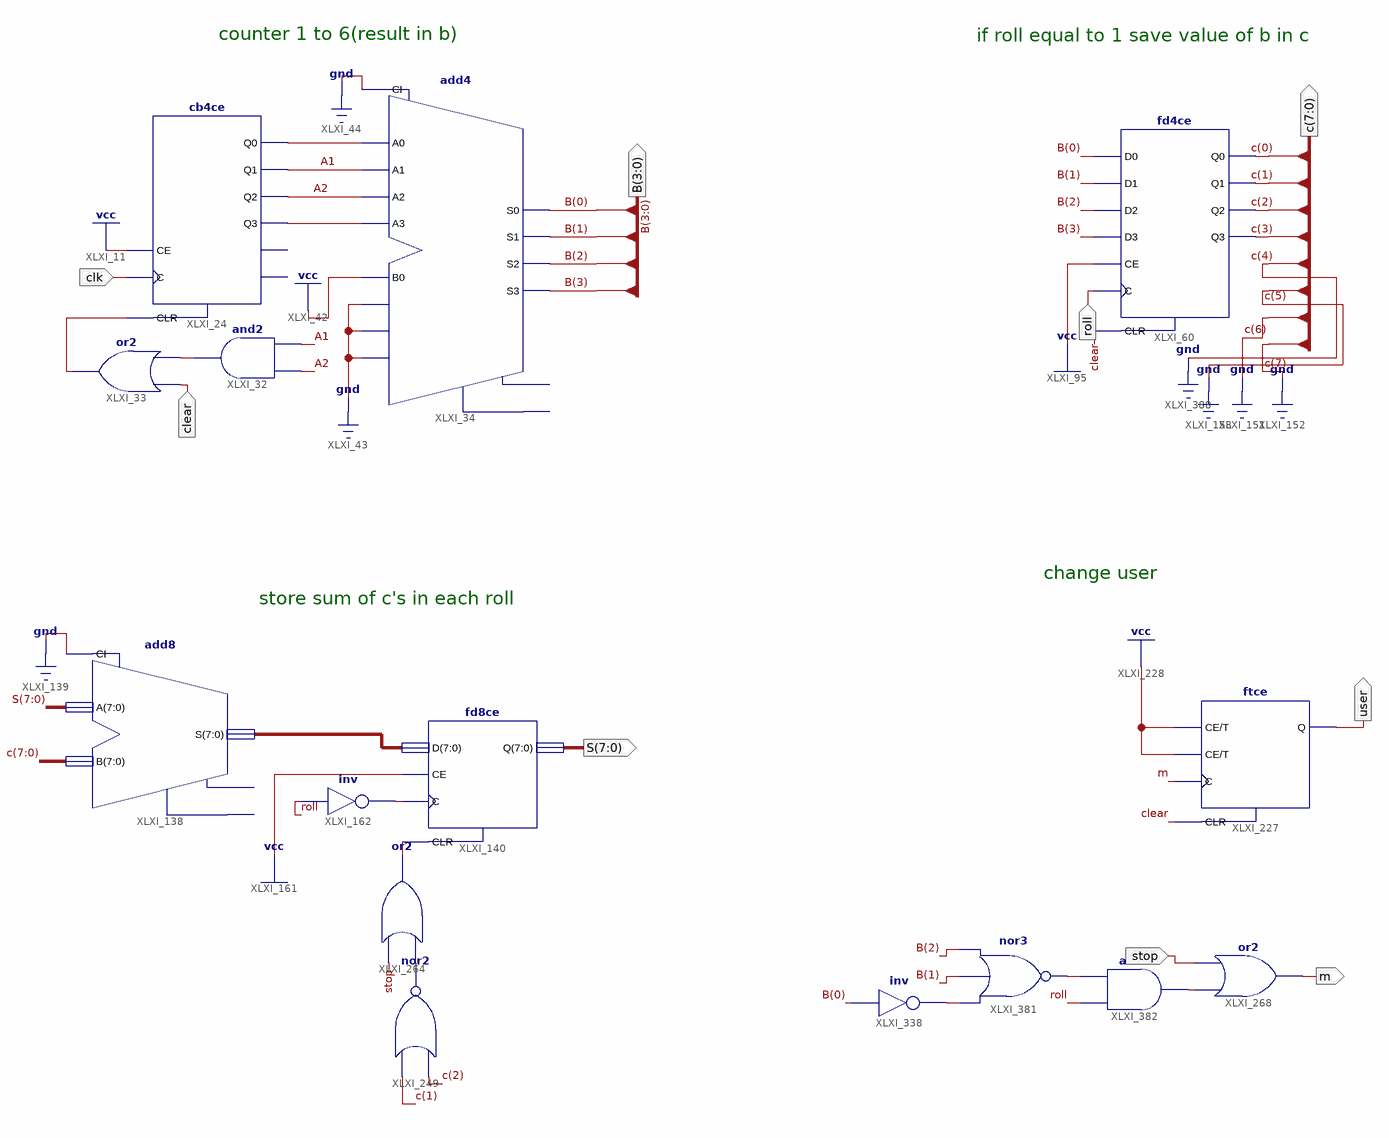
[diagram p0: schematic sheet 1]
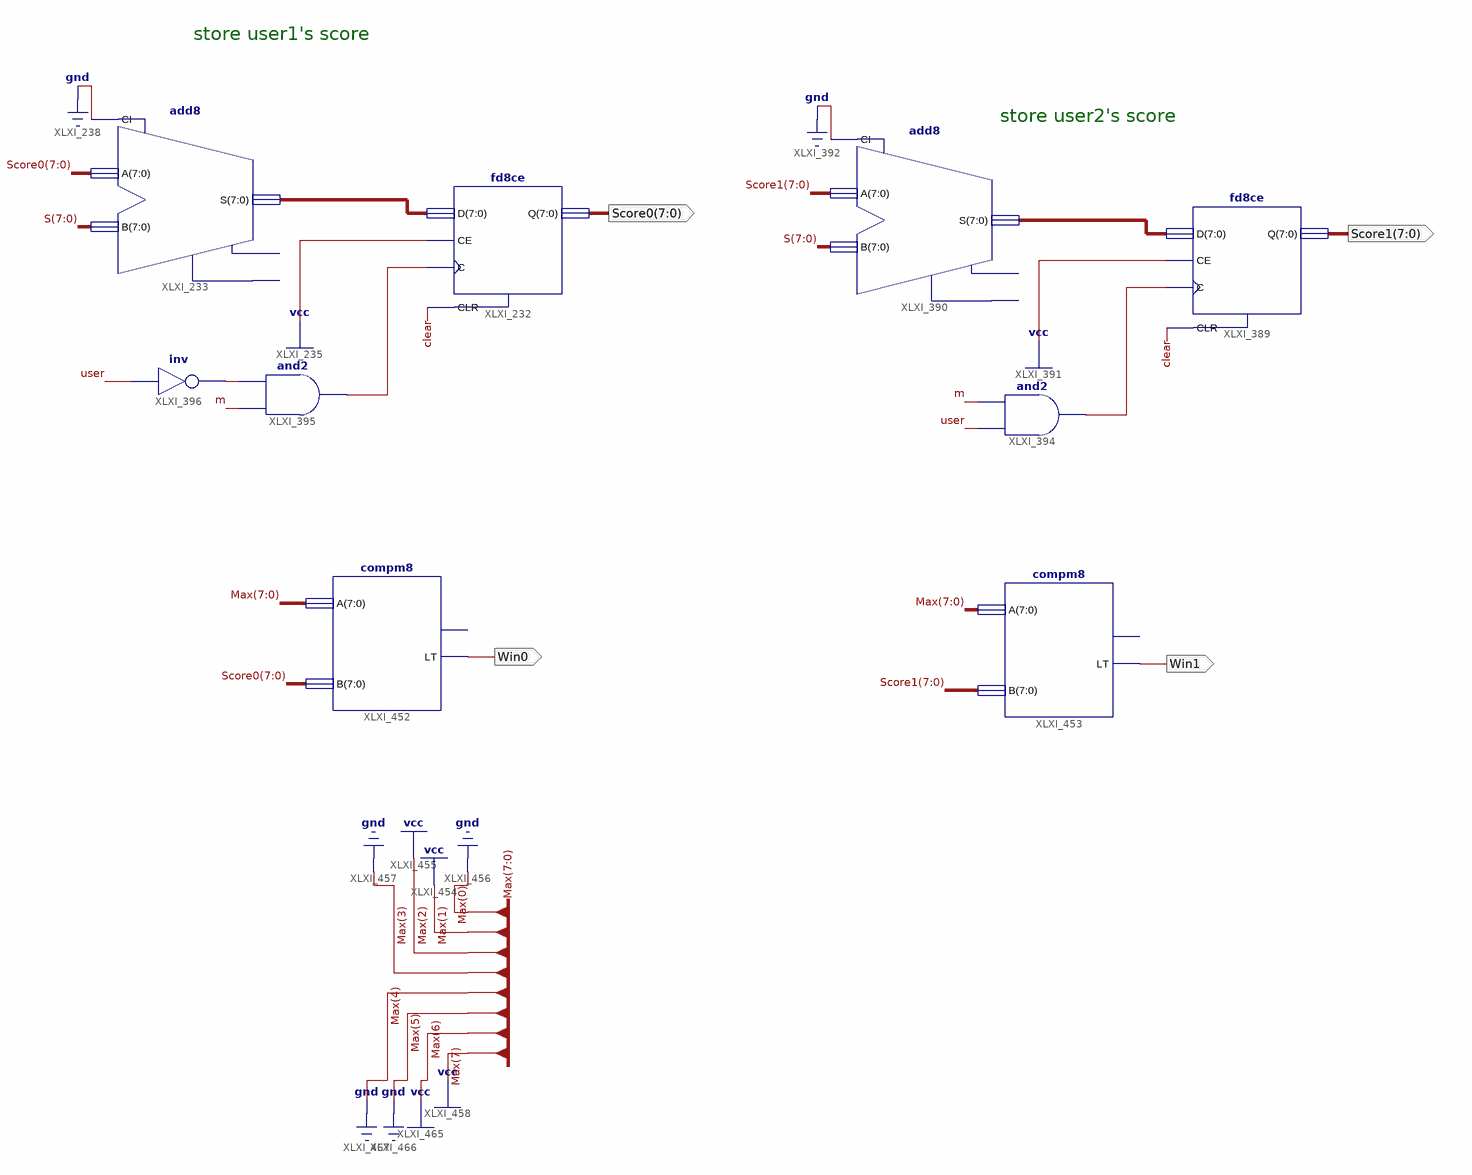
[diagram p1: schematic sheet 2]
// Xilinx ISE schematic test4.sch (artix7) as structural Verilog: 24 symbols, 13 ports
module test4 (
  input  clear,
  input  clk,
  input  roll,
  input  stop,
  output [7:0] c,
  output [3:0] B,
  output [7:0] S,
  output user,
  output m,
  output [7:0] Score0,
  output [7:0] Score1,
  output Win0,
  output Win1
);

  wire A1, A2, XLXN_56, XLXN_58, XLXN_103, XLXN_113, XLXN_474, XLXN_638, XLXN_671, XLXN_811, XLXN_955,
       XLXN_967, XLXN_982, XLXN_986, XLXN_987;
  wire [7:0] SM, XLXN_621, XLXN_975;

  fd4ce XLXI_60 (
    .C(roll), .CE(1'b1), .CLR(clear), .D0(B[0]), .D1(B[1]), .D2(B[2]), .D3(B[3]), .Q0(c[0]), .Q1(c[1]),
    .Q2(c[2]), .Q3(c[3]));
  add4 XLXI_34 (
    .A0(XLXN_103), .A1(A1), .A2(A2), .A3(XLXN_113), .B0(1'b1), .B1(1'b0), .B2(1'b0), .B3(1'b0), .CI(1'b0),
    .S0(B[0]), .S1(B[1]), .S2(B[2]), .S3(B[3]));  // open: CO, OFL
  cb4ce XLXI_24 (.C(clk), .CE(1'b1), .CLR(XLXN_58), .Q0(XLXN_103), .Q1(A1), .Q2(A2), .Q3(XLXN_113));  // open: CEO, TC
  and XLXI_32 (XLXN_56, A1, A2);
  or XLXI_33 (XLXN_58, XLXN_56, clear);
  fd8ce XLXI_140 (.C(XLXN_474), .CE(1'b1), .CLR(XLXN_638), .D(SM), .Q(S));
  add8 XLXI_138 (.A(S), .B({4'b0000, c[3:0]}), .CI(1'b0), .S(SM));  // open: CO, OFL
  not XLXI_162 (XLXN_474, roll);
  nor XLXI_249 (XLXN_671, c[2], c[1]);
  or XLXI_264 (XLXN_638, XLXN_671, stop);
  ftce XLXI_227 (.C(m), .CE(1'b1), .CLR(clear), .T(1'b1), .Q(user));
  not XLXI_338 (XLXN_811, B[0]);
  nor XLXI_381 (XLXN_955, XLXN_811, B[1], B[2]);
  and XLXI_382 (XLXN_967, roll, XLXN_955);
  or XLXI_268 (m, XLXN_967, stop);
  fd8ce XLXI_232 (.C(XLXN_987), .CE(1'b1), .CLR(clear), .D(XLXN_621), .Q(Score0));
  add8 XLXI_233 (.A(Score0), .B(S), .CI(1'b0), .S(XLXN_621));  // open: CO, OFL
  and XLXI_395 (XLXN_987, m, XLXN_982);
  not XLXI_396 (XLXN_982, user);
  fd8ce XLXI_389 (.C(XLXN_986), .CE(1'b1), .CLR(clear), .D(XLXN_975), .Q(Score1));
  add8 XLXI_390 (.A(Score1), .B(S), .CI(1'b0), .S(XLXN_975));  // open: CO, OFL
  and XLXI_394 (XLXN_986, user, m);
  compm8 XLXI_452 (.A(8'b11000110), .B(Score0), .LT(Win0));  // open: GT
  compm8 XLXI_453 (.A(8'b11000110), .B(Score1), .LT(Win1));  // open: GT

  assign c[7:4] = 4'b0000;

  // Notes on the sheet:
  //   counter 1 to 6(result in b)
  //   if roll equal to 1 save value of b in c
  //   change user
  //   store sum of c's in each roll
  //   store user1's score
  //   store user2's score
endmodule
